# EAGLE design rev3 (EAGLE 6.4)
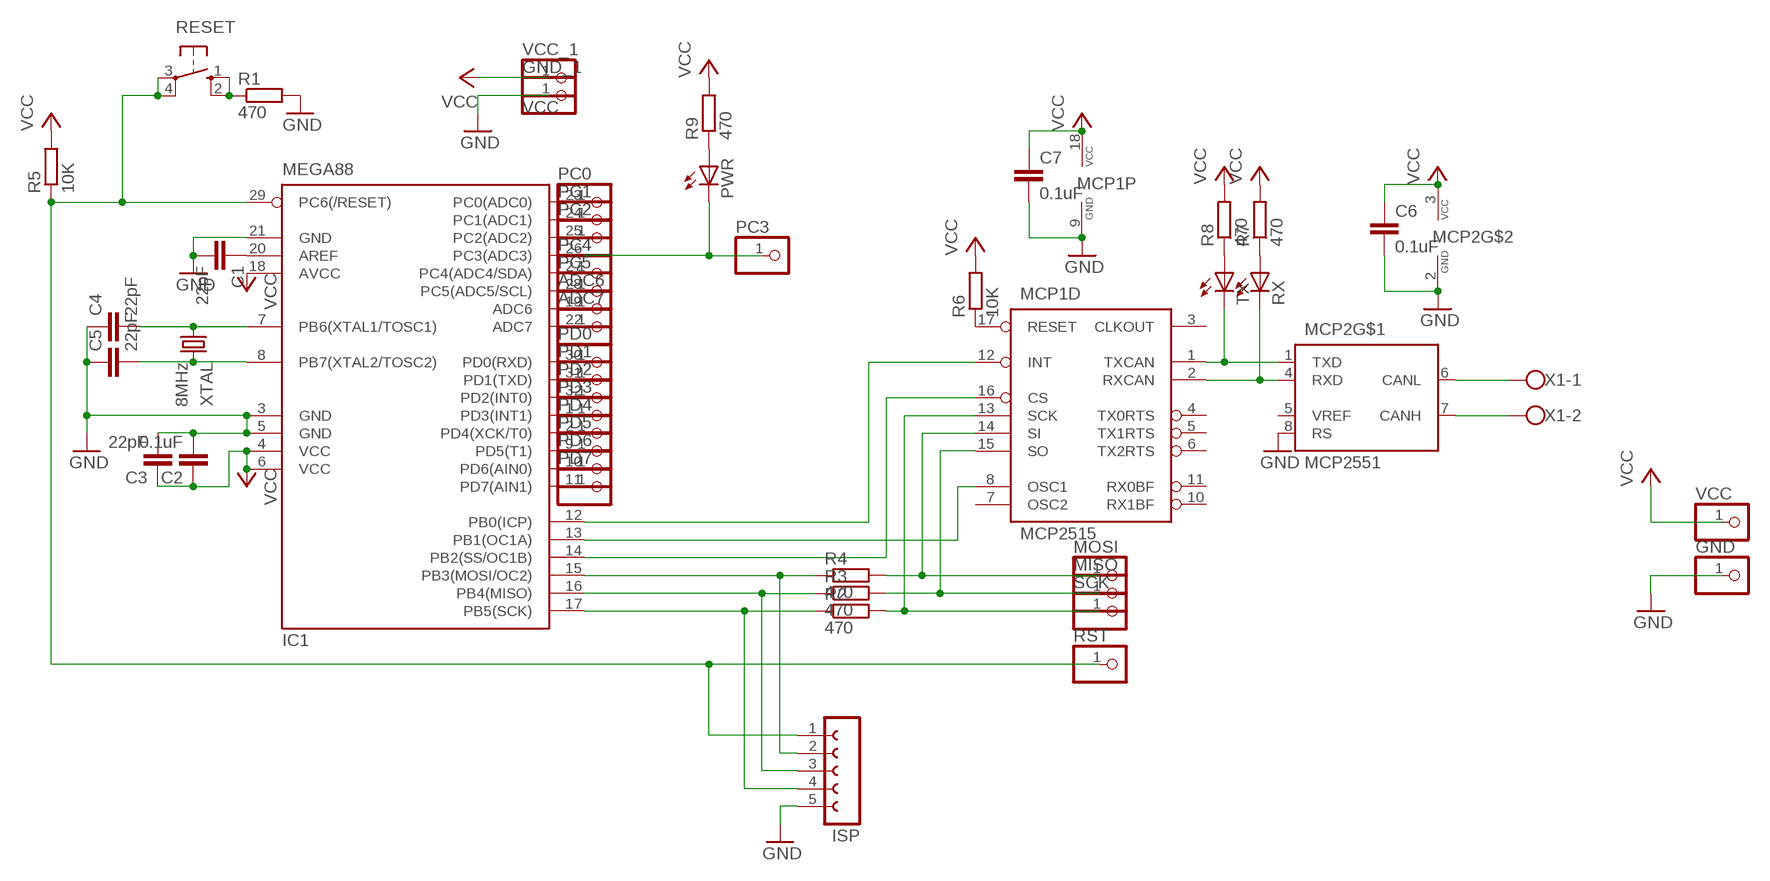
[diagram p0: schematic, sheet 1]

## Parts
ADC6  PINHD-1X1  [1X01]
ADC7  PINHD-1X1  [1X01]
C1  22pF  C-EUC0603  [C0603]
C2  0.1uF  C-EUC0603  [C0603]
C3  22pF  C-EUC0603  [C0603]
C4  22pF  C-EUC0603  [C0603]
C5  22pF  C-EUC0603  [C0603]
C6  0.1uF  C-EUC0603  [C0603]
C7  0.1uF  C-EUC0603  [C0603]
GND  PINHD-1X1  [1X01]
GND_1  PINHD-1X1  [1X01]
IC1  MEGA88  MEGA8-AI  [TQFP32-08]
ISP  FE05-1  [FE05-1]
MCP1  MCP2515  MCP2515P  [DIL18]
MCP2  MCP2551  MCP2551DIL8  [DIL08]
MISO  PINHD-1X1  [1X01]
MOSI  PINHD-1X1  [1X01]
PC0  PINHD-1X1  [1X01]
PC1  PINHD-1X1  [1X01]
PC2  PINHD-1X1  [1X01]
PC3  PINHD-1X1  [1X01]
PC4  PINHD-1X1  [1X01]
PC5  PINHD-1X1  [1X01]
PD0  PINHD-1X1  [1X01]
PD1  PINHD-1X1  [1X01]
PD2  PINHD-1X1  [1X01]
PD3  PINHD-1X1  [1X01]
PD4  PINHD-1X1  [1X01]
PD5  PINHD-1X1  [1X01]
PD6  PINHD-1X1  [1X01]
PD7  PINHD-1X1  [1X01]
PWR  LEDCHIP-LED0603  [CHIP-LED0603]
R1  470  R-EU_R0603  [R0603]
R2  470  R-EU_R0603  [R0603]
R3  470  R-EU_R0603  [R0603]
R4  470  R-EU_R0603  [R0603]
R5  10K  R-EU_R0603  [R0603]
R6  10K  R-EU_R0603  [R0603]
R7  470  R-EU_R0603  [R0603]
R8  470  R-EU_R0603  [R0603]
R9  470  R-EU_R0603  [R0603]
RESET  10-XX  [B3F-10XX]
RST  PINHD-1X1  [1X01]
RX  LEDCHIP-LED0603  [CHIP-LED0603]
SCK  PINHD-1X1  [1X01]
TX  LEDCHIP-LED0603  [CHIP-LED0603]
VCC  PINHD-1X1  [1X01]
VCC_1  VCC  PINHD-1X1  [1X01]
X1  W237-102  [W237-102]
XTAL  8MHz  CRYSTALHC49S  [HC49/S]

## Nets
GND: C1.2 C2.2 C3.2 C4.1 C5.1 C6.2 C7.2 GND.1 GND_1.1 IC1.3(GND) IC1.5(GND) IC1.21(GND) ISP.5 MCP1.9(P:GND) MCP2.2(GND) MCP2.8(RS) R1.2
N$1: C1.1 IC1.20(AREF)
N$2: IC1.16(PB4(MISO)) ISP.3 R3.1
N$3: MCP1.14(D:SI) MOSI.1 R4.2
N$4: IC1.14(PB2(SS/OC1B)) MCP1.16(D:CS)
N$5: IC1.13(PB1(OC1A)) MCP1.8(D:OSC1)
N$7: MCP1.1(D:TXCAN) MCP2.1(TXD) TX.C
N$9: C5.2 IC1.8(PB7(XTAL2/TOSC2)) XTAL.2
N$10: MCP2.6(CANL) X1.1
N$12: MCP1.17(D:RESET) R6.1
N$13: R1.1 RESET.1(S) RESET.2(S1)
N$14: IC1.12(PB0(ICP)) MCP1.12(D:INT)
N$15: MCP1.13(D:SCK) R2.2 SCK.1
N$16: MCP2.7(CANH) X1.2
N$17: IC1.15(PB3(MOSI/OC2)) ISP.2 R4.1
N$18: R8.1 TX.A
N$19: R7.1 RX.A
N$20: IC1.23(PC0(ADC0)) PC0.1
N$21: IC1.24(PC1(ADC1)) PC1.1
N$22: IC1.25(PC2(ADC2)) PC2.1
N$24: IC1.27(PC4(ADC4/SDA)) PC4.1
N$25: IC1.28(PC5(ADC5/SCL)) PC5.1
N$26: ADC6.1 IC1.19(ADC6)
N$27: ADC7.1 IC1.22(ADC7)
N$28: IC1.30(PD0(RXD)) PD0.1
N$29: IC1.31(PD1(TXD)) PD1.1
N$30: IC1.32(PD2(INT0)) PD2.1
N$31: IC1.1(PD3(INT1)) PD3.1
N$32: IC1.2(PD4(XCK/T0)) PD4.1
N$33: IC1.9(PD5(T1)) PD5.1
N$34: IC1.10(PD6(AIN0)) PD6.1
N$35: IC1.11(PD7(AIN1)) PD7.1
N$36: PWR.A R9.1
N$37: C4.2 IC1.7(PB6(XTAL1/TOSC1)) XTAL.1
N$38: MCP1.15(D:SO) MISO.1 R3.2
N$39: IC1.17(PB5(SCK)) ISP.4 R2.1
N$40: IC1.26(PC3(ADC3)) PC3.1 PWR.C
RESET: IC1.29(PC6(/RESET)) ISP.1 R5.1 RESET.3(P) RESET.4(P1) RST.1
RXLED: MCP1.2(D:RXCAN) MCP2.4(RXD) RX.C
VCC: C2.1 C3.1 C6.1 C7.1 IC1.4(VCC) IC1.6(VCC) IC1.18(AVCC) MCP1.18(P:VCC) MCP2.3(VCC) R5.2 R6.2 R7.2 R8.2 R9.2 VCC.1 VCC_1.1
Unconnected: MCP1.3(D:CLKOUT) MCP1.4(D:TX0RTS) MCP1.5(D:TX1RTS) MCP1.6(D:TX2RTS) MCP1.7(D:OSC2) MCP1.10(D:RX1BF) MCP1.11(D:RX0BF) MCP2.5(VREF)

## Library data of the parts
ADC6 ADC7 GND GND_1 MISO MOSI PC0 PC1-PC5 PD0 PD1-PD7 RST SCK VCC VCC_1 = pinhead:PINHD-1X1: PIN HEADER
C1-C7 = resistor:C-EU: CAPACITOR, European symbol; OC_NEWARK: unknown
IC1 = atmel:MEGA8: MICROCONTROLLER 8 Kbytes FLASH, 1 kbytes SRAM, 512 bytes EEPROM, USART, 6-channel 10 bit ADC, 2-channel 8 bit ADC Pin compatible with Atmega48, ATMega88, ATMega168 Source: avr.lbr; MPN: ATMEGA8-16AU; OC_FARNELL: 9171371; OC_NEWARK: unknown
ISP = con-lsta:FE05-1: FEMALE HEADER; OC_FARNELL: unknown; OC_NEWARK: unknown
MCP1 = can:MCP2515: MC2515 Stand-Alone CAN Controller With SPI Interface, Microchip; OC_NEWARK: unknown
MCP2 = can:MCP2551: CAN Tranceiver Microchip; OC_NEWARK: unknown
PWR RX TX = led:LED: LED OSRAM: - CHIPLED LG R971, LG N971, LY N971, LG Q971, LY Q971, LO R971, LY R971 LH N974, LH R974 LS Q976, LO Q976, LY Q976 LO Q996 - Hyper CHIPLED LW Q18S LB Q993, LB Q99A, LB R99A - SideLED LS A670, LO A670, LY A670, LG A670, LP A670 LB A673, LV A673, LT A673, LW A673 LH A674 LY A675 LS A676, LA A676, LO A676, LY A676, LW A676 LS A679, LY A679, LG A679 - Hyper Micro SIDELED® LS Y876, LA Y876, LO Y876, LY Y876 LT Y87S - SmartLED LW L88C, LW L88S LB L89C, LB L89S, LG L890 LS L89K, LO L89K, LY L89K LS L896, LA L896, LO L896, LY L896 - TOPLED LS T670, LO T670, LY T670, LG T670, LP T670 LSG T670, LSP T670, LSY T670, LOP T670, LYG T670 LG T671, LOG T671, LSG T671 LB T673, LV T673, LT T673, LW T673 LH T674 LS T676, LA T676, LO T676, LY T676, LB T676, LH T676, LSB T676, LW T676 LB T67C, LV T67C, LT T67C, LS T67K, LO T67K, LY T67K, LW E67C LS E67B, LA E67B, LO E67B, LY E67B, LB E67C, LV E67C, LT E67C LW T67C LS T679, LY T679, LG T679 LS T770, LO T770, LY T770, LG T770, LP T770 LB T773, LV T773, LT T773, LW T773 LH T774 LS E675, LA E675, LY E675, LS T675 LS T776, LA T776, LO T776, LY T776, LB T776 LHGB T686 LT T68C, LB T68C - Hyper Mini TOPLED® LB M676 - Mini TOPLED Santana® LG M470 LS M47K, LO M47K, LY M47K Source: http://www.osram.convergy.de LUXEON: - LUMILED® LXK2-PW12-R00, LXK2-PW12-S00, LXK2-PW14-U00, LXK2-PW14-V00 LXK2-PM12-R00, LXK2-PM12-S00, LXK2-PM14-U00 LXK2-PE12-Q00, LXK2-PE12-R00, LXK2-PE12-S00, LXK2-PE14-T00, LXK2-PE14-U00 LXK2-PB12-K00, LXK2-PB12-L00, LXK2-PB12-M00, LXK2-PB14-N00, LXK2-PB14-P00, LXK2-PB14-Q00 LXK2-PR12-L00, LXK2-PR12-M00, LXK2-PR14-Q00, LXK2-PR14-R00 LXK2-PD12-Q00, LXK2-PD12-R00, LXK2-PD12-S00 LXK2-PH12-R00, LXK2-PH12-S00 LXK2-PL12-P00, LXK2-PL12-Q00, LXK2-PL12-R00 Source: www.luxeon.com KINGBRIGHT: KA-3528ASYC Source: www.kingbright.com
R1-R9 = resistor:R-EU_: RESISTOR, European symbol; OC_NEWARK: unknown
RESET = switch-omron:10-XX: OMRON SWITCH; MPN: B3F-1000; OC_FARNELL: 176432; OC_NEWARK: 36M3542
X1 = con-wago-500:W237-102: WAGO SCREW CLAMP; MPN: 237-102; OC_FARNELL: unknown; OC_NEWARK: 70K9898
XTAL = crystal:CRYSTAL: CRYSTAL; OC_FARNELL: 1667008; OC_NEWARK: unknown

## Board
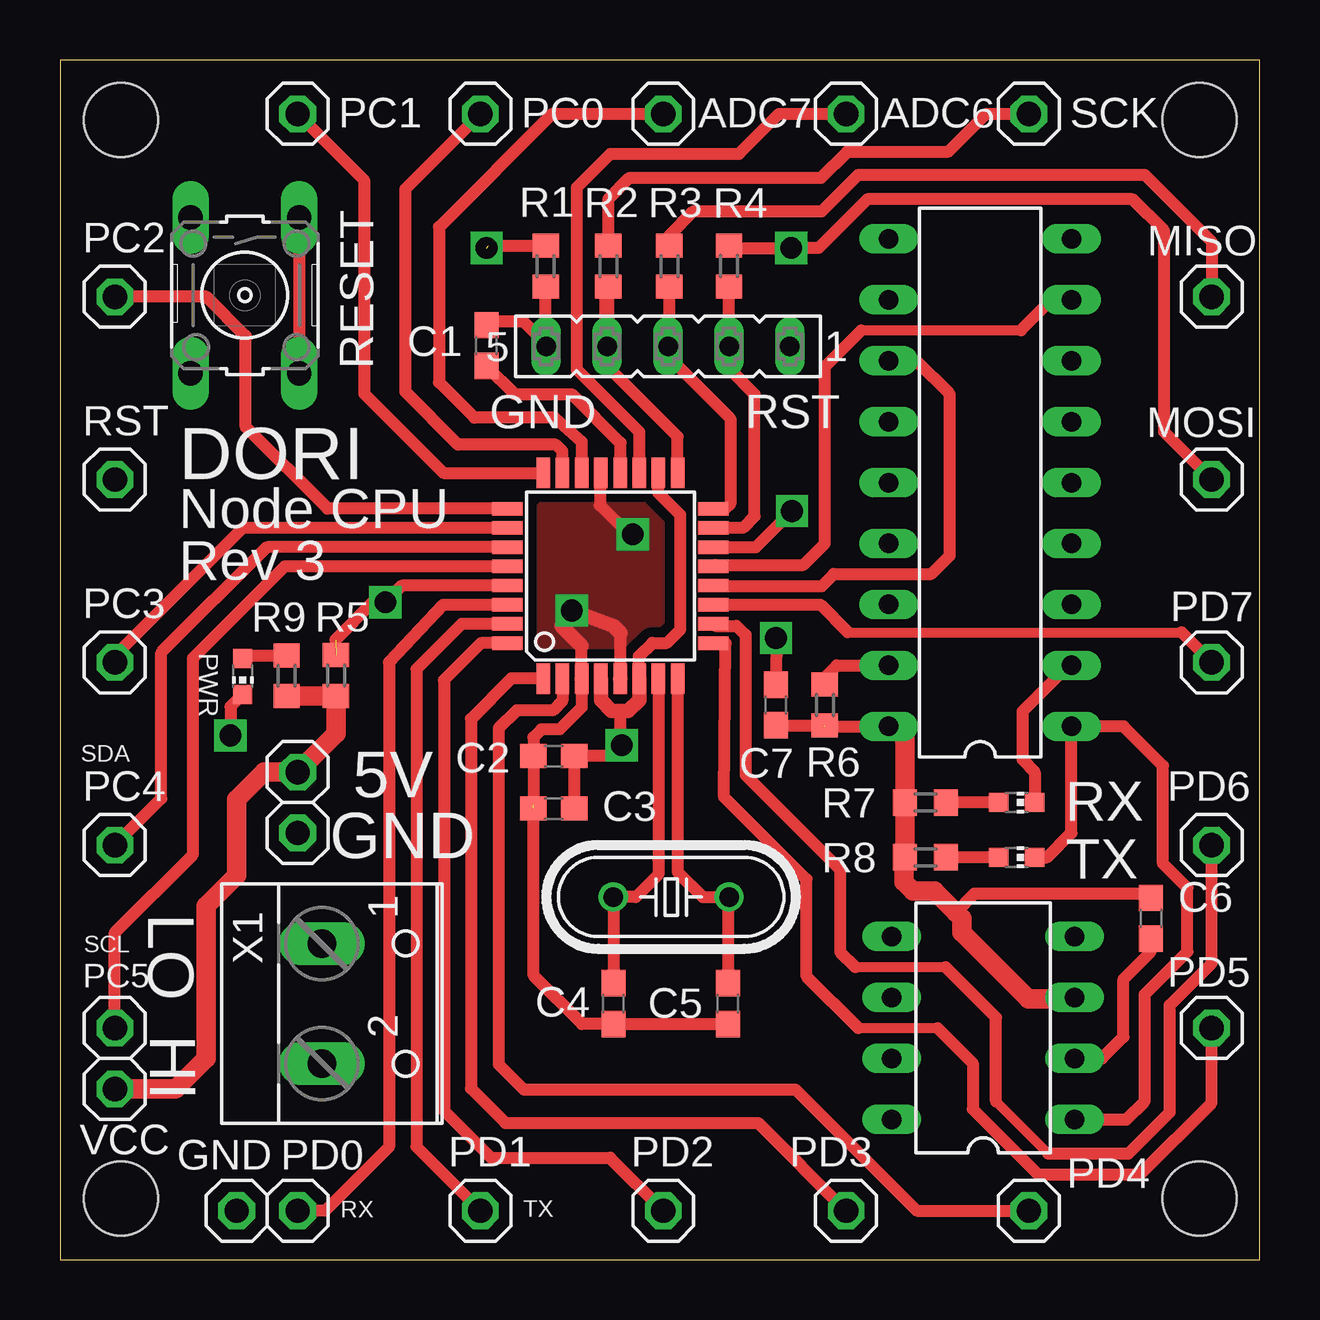
[diagram p1: board, top side]
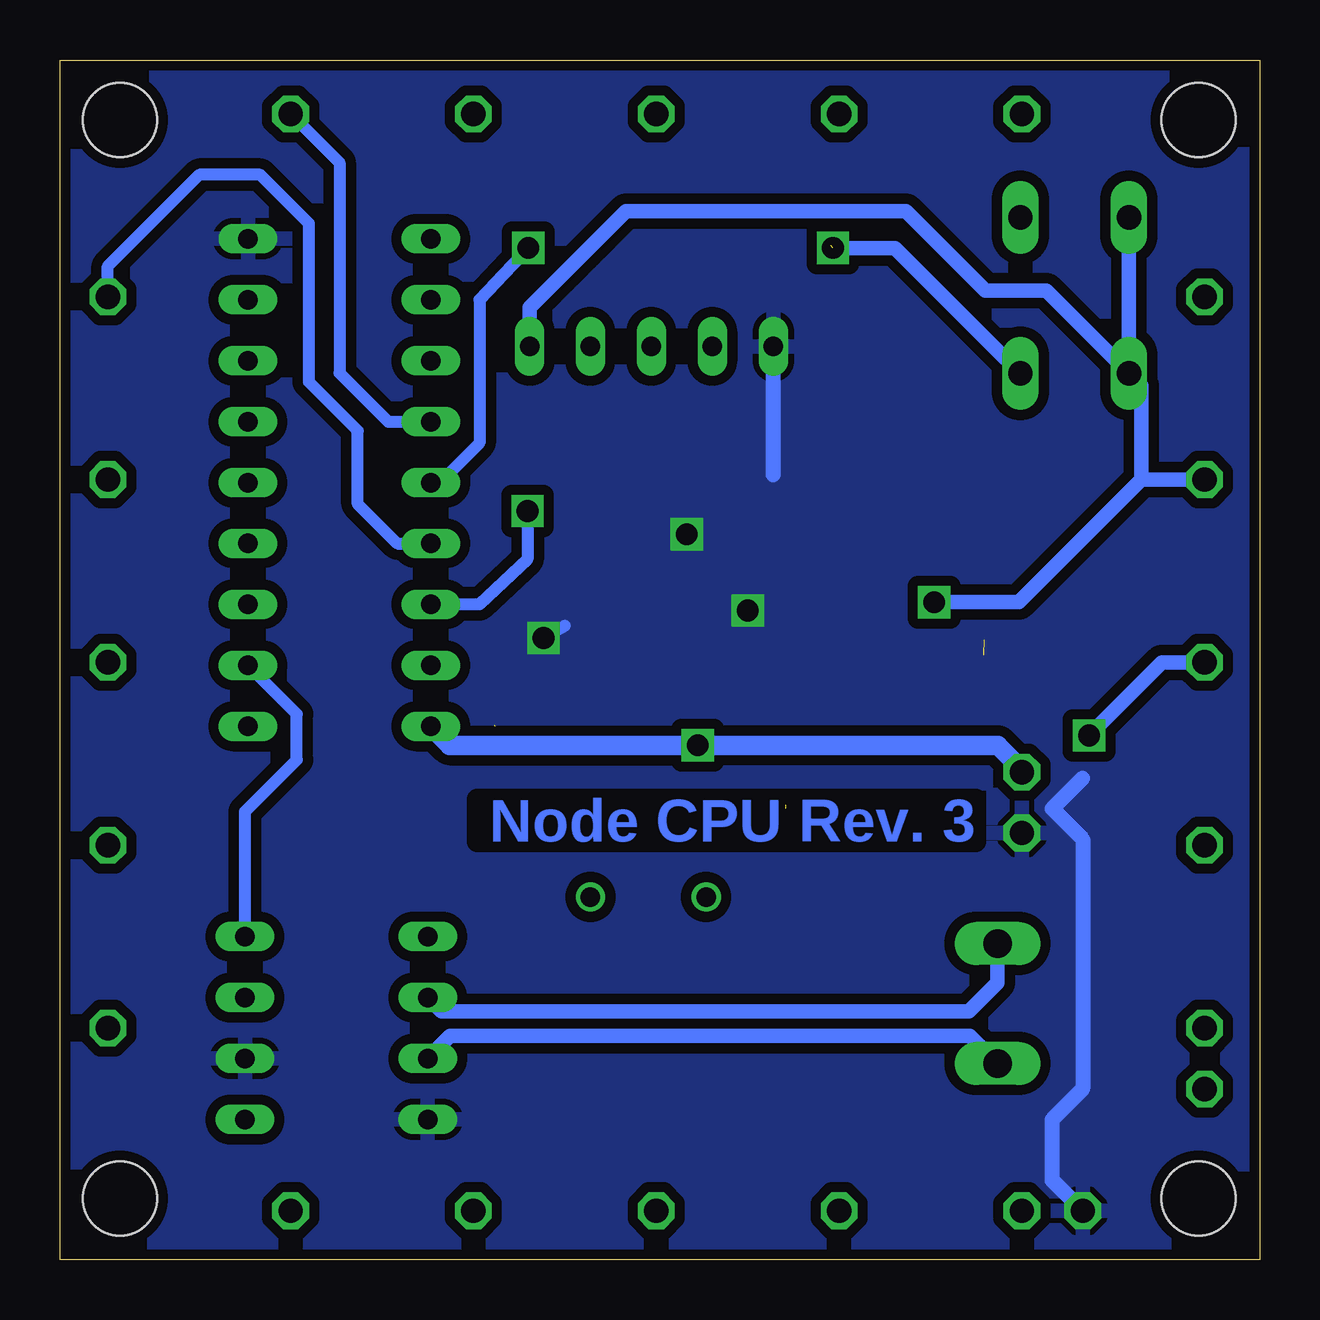
[diagram p2: board, bottom side, seen from below]

Size 50 x 50 mm. Coordinates in mm from the lower left corner, seen from the top.
Outline: 0,0 50,0 50,50 0,50 0,0
Copper layers (1*2*15*16): Top 0.035mm / dielectric 0.2mm / layer 2 0.0175mm / dielectric 1.1mm / layer 15 0.0175mm / dielectric 0.2mm / Bottom 0.035mm
Design rules "SeeedStudio_DRU_no_angle_20130527": minimum track width 6mil, minimum drill 12mil, track to track 6mil, track to pad 6mil, pad to pad 6mil, via to via 6mil, smd to smd 0mil, copper to edge 10mil, drill to drill 10mil, minimum pad ring 6mil, minimum via ring 6mil, stop-mask expansion 2mil, vias tented up to drill 25mil, thermal gap 10mil
Holes 3.1 mm at 2.54,47.5 47.5,47.5 47.5,2.54 2.54,2.54

### Footprints (pad centres in the part's own frame; a part is rotated, then mirrored left to right if it is on the bottom)
1X01 = drill 1.016 octagon: 1 0,0
C0603 = smd 1.1 x 1: 1 -0.85,0; 2 0.85,0
TQFP32-08 = smd 1.27 x 0.559: 1 -4.293,2.8; 2 -4.293,2; 3 -4.293,1.2; 4 -4.293,0.4; 5 -4.293,-0.4; 6 -4.293,-1.2; 7 -4.293,-2; 8 -4.293,-2.8; 17 4.293,-2.8; 18 4.293,-2; 19 4.293,-1.2; 20 4.293,-0.4; 21 4.293,0.4; 22 4.293,1.2; 23 4.293,2; 24 4.293,2.8 | smd 0.559 x 1.27: 9 -2.8,-4.293; 10 -2,-4.293; 11 -1.2,-4.293; 12 -0.4,-4.293; 13 0.4,-4.293; 14 1.2,-4.293; 15 2,-4.293; 16 2.8,-4.293; 25 2.8,4.293; 26 2,4.293; 27 1.2,4.293; 28 0.4,4.293; 29 -0.4,4.293; 30 -1.2,4.293; 31 -2,4.293; 32 -2.8,4.293
FE05-1 = drill 0.813 long: 1 -5.08,0; 2 -2.54,0; 3 0,0; 4 2.54,0; 5 5.08,0
DIL18 = drill 0.813 long: 1 -10.16,-3.81; 2 -7.62,-3.81; 3 -5.08,-3.81; 4 -2.54,-3.81; 5 0,-3.81; 6 2.54,-3.81; 7 5.08,-3.81; 8 7.62,-3.81; 9 10.16,-3.81; 10 10.16,3.81; 11 7.62,3.81; 12 5.08,3.81; 13 2.54,3.81; 14 0,3.81; 15 -2.54,3.81; 16 -5.08,3.81; 17 -7.62,3.81; 18 -10.16,3.81
DIL08 = drill 0.813 long: 1 -3.81,-3.81; 2 -1.27,-3.81; 3 1.27,-3.81; 4 3.81,-3.81; 5 3.81,3.81; 6 1.27,3.81; 7 -1.27,3.81; 8 -3.81,3.81
CHIP-LED0603 = smd 0.8 x 0.8: A 0,-0.75; C 0,0.75
R0603 = smd 1 x 1.1: 1 -0.85,0; 2 0.85,0
B3F-10XX = drill 1.016 long: 1 -3.251,2.261; 2 3.251,2.261; 3 -3.251,-2.261; 4 3.251,-2.261
W237-102 = drill 1.194 long: 1 -2.5,-1.27; 2 2.5,-1.27
HC49/S = drill 0.813: 1 -2.413,0; 2 2.413,0

### Placement (x,y rotation side)
ADC6  32.77,47.75 0 top
ADC7  25.15,47.75 0 top
C1  17.78,38.1 90 top
C2  20.58,20.99 180 top
C3  20.58,18.8 180 top
C4  23.06,10.67 90 top
C5  27.84,10.67 90 top
C6  45.47,14.22 270 top
C7  29.84,23.11 90 top
GND  7.37,2.03 0 top
GND_1  9.91,17.78 0 top
IC1  22.95,28.49 90 top
ISP  25.35,38.06 180 top
MCP1  38.35,32.38 90 top
MCP2  38.48,9.65 90 top
MISO  48.01,40.13 0 top
MOSI  48.01,32.51 0 top
PC0  17.53,47.75 0 top
PC1  9.91,47.75 0 top
PC2  2.29,40.13 0 top
PC3  2.29,24.89 0 top
PC4  2.29,17.27 0 top
PC5  2.29,9.65 0 top
PD0  9.91,2.03 0 top
PD1  17.53,2.03 0 top
PD2  25.15,2.03 0 top
PD3  32.77,2.03 0 top
PD4  40.39,2.03 0 top
PD5  48.01,9.65 0 top
PD6  48.01,17.27 0 top
PD7  48.01,24.89 0 top
PWR  7.62,24.31 180 top
R1  20.25,41.4 270 top
R2  22.86,41.4 90 top
R3  25.4,41.4 90 top
R4  27.89,41.4 90 top
R5  11.5,24.35 270 top
R6  31.88,23.11 270 top
R7  36.07,19.05 180 top
R8  36.07,16.76 180 top
R9  9.45,24.33 270 top
RESET  7.71,40.19 270 top
RST  2.29,32.51 0 top
RX  39.88,19.05 270 top
SCK  40.39,47.75 0 top
TX  39.88,16.76 270 top
VCC  2.29,7.11 0 top
VCC_1  9.91,20.32 0 top
X1  12.19,10.67 270 top
XTAL  25.48,15.11 0 top

### Tracks (layer width: path | path; a pad name or v marks a point on that pad's centre or on a via)
GND  (via drill 0.9)  (1 unrouted)
  Top 0.508: C5.1 C4.1 21.76,9.82 19.75,11.83 19.75,18.94 | C3.2 C2.2 19.73,21.77 20.07,22.1 20.83,22.1 21.75,23.02 IC1.3 | 20.27,36.97 ISP.5 20.25,38.08 20.25,38.61 | 20.25,38.61 R1.2 | IC1.21 22.5,32.74 22.5,31.45 23.47,30.48 v23.88,30.23 | C1.2 17.95,39.12 19.3,39.12 19.81,38.61 20.25,38.61 | 23.37,24.22 23.37,26.11 | IC1.3 21.74,25.58 | MCP2.2 43.43,8.38 44.32,9.27 44.32,11.68 45.47,12.83 C6.2 | C7.2 29.88,25.49 v29.84,25.91
  Top 0.61: IC1.3 | 21.74,25.58 20.9,26.42 v21.34,27.05 23.06,26.42 23.37,26.11 | IC1.5 23.37,24.22
  Bottom 0.508: v29.84,25.91 28.96,26.42
  Bottom 0.635: 20.27,32.71 ISP.5 | 7.37,20.07 8.64,18.8 7.37,17.53 7.37,7.11 8.64,5.84 8.64,3.3 GND.1
  pour Bottom (isolate 0.432): -0.51,-0.51 50.29,-0.51 50.29,50.29 -0.51,50.29
  pour Top (isolate 0.406): 20.07,31.37 20.07,25.65 26.04,25.65 26.04,31.37
N$1
  Top 0.508: IC1.20 23.37,32.81 23.37,34.04 21.34,36.07 18.96,36.07 C1.1
N$2
  Top 0.508: IC1.16 27.74,31.29 27.94,31.5 27.94,35.05 25.4,37.59 25.4,38.01 ISP.3 25.4,38.12 R3.1
N$3  (via drill 0.9)
  Top 0.508: R4.2 27.94,42.16 v30.48,42.16 31.62,42.16 33.66,44.2 44.7,44.2 46.02,42.88 46.02,34.49 MOSI.1
  Bottom 0.508: v30.48,42.16 32.51,40.01 32.51,34.04 34.16,32.38 MCP1.14
N$4  (via drill 0.9)
  Top 0.508: IC1.14 29,29.69 v30.51,31.2
  Bottom 0.508: v30.51,31.2 30.51,29.18 32.51,27.3 MCP1.16
N$5
  Top 0.406: 33.4,38.73 40.06,38.73
  Top 0.508: IC1.13 27.3,28.96 30.99,28.96 31.88,29.84 31.88,37.21 33.4,38.73 | 40.06,38.73 41.45,40.13 MCP1.8
N$7
  Top 0.508: MCP2.1 44.45,5.84 45.21,6.6 45.21,11.05 46.99,12.83 46.99,15.49 45.97,16.51 45.97,20.57 44.32,22.23 MCP1.1 42.16,17.78 41.15,16.76 TX.C
N$9
  Top 0.508: IC1.8 25.75,16.75 25.75,16.16 26.8,15.11 XTAL.2 27.84,14.94 C5.2
N$10
  Bottom 0.61: MCP2.6 34.09,10.34 12.12,10.34 10.92,11.53 X1.1
N$12
  Top 0.508: R6.1 31.88,24.26 32.38,24.77 MCP1.17
N$13  (via drill 0.9)  (1 unrouted)
  Top 0.508: RESET.1 RESET.2 | 17.87,42.25 R1.1
  Bottom 0.61: RESET.2 11.13,38.1 15.19,42.16 v17.78,42.16
N$14
  Top 0.508: IC1.12 27.26,28.07 31.75,28.07 32.26,28.57 36.32,28.57 37.08,29.34 37.08,36.07 35.69,37.47 MCP1.12
N$15
  Top 0.508: SCK.1 38.61,47.75 37.03,46.18 32.82,46.18 31.73,45.09 23.75,45.09 22.86,44.2 R2.2
  Bottom 0.508: SCK.1 38.35,45.72 38.35,36.96 36.32,34.92 MCP1.13
N$16
  Bottom 0.61: X1.2 12.08,9.32 33.73,9.32 MCP2.7
N$17
  Top 0.508: IC1.15 28.46,30.49 28.96,30.99 28.96,36.07 27.94,37.08 27.94,38.01 ISP.2 R4.1
N$18
  Top 0.508: TX.A R8.1
N$19
  Top 0.508: RX.A R7.1
N$20
  Top 0.508: IC1.23 20.95,33.69 20.67,33.97 16.6,33.97 14.4,36.17 14.4,44.63 PC0.1
N$21
  Top 0.508: IC1.24 15.98,32.78 12.69,36.08 12.69,44.97 PC1.1
N$22
  Top 0.508: IC1.25 11.15,31.29 7.75,34.69 7.75,38.49 6.11,40.13 PC2.1 2.33,40.09
N$24
  Top 0.508: PC4.1 4.23,19.21 4.23,25.29 8.63,29.69 IC1.27
N$25
  Top 0.508: IC1.28 9.37,28.89 5.55,25.07 5.55,16.89 2.29,13.63 PC5.1
N$26
  Top 0.508: IC1.19 24.15,34.49 21.55,37.09 21.55,44.69 22.95,46.09 28.31,46.09 29.97,47.75 ADC6.1
N$27
  Top 0.508: IC1.22 21.75,34.09 20.62,35.09 17.27,35.09 15.8,36.56 15.8,43.03 20.52,47.75 ADC7.1
N$28
  Top 0.508: IC1.30 15.99,27.29 13.71,24.89 13.71,4.7 11.05,2.03 PD0.1
N$29
  Top 0.508: IC1.31 16.75,26.49 14.86,24.61 14.86,4.7 PD1.1 17.53,2.11
N$30
  Top 0.508: IC1.32 17.55,25.69 16,24.15 16,6.2 17.96,4.24 22.94,4.24 PD2.1
N$31
  Top 0.508: IC1.1 20.17,24.22 18.81,24.22 17.13,22.54 17.13,7.13 18.57,5.69 29.11,5.69 PD3.1
N$32
  Top 0.508: IC1.2 20.95,23.29 20.55,22.89 19.05,22.89 18.29,22.14 18.29,8.13 19.32,7.09 20.76,7.09 21.59,7.09 30.65,7.09 35.71,2.03 PD4.1
N$33
  Top 0.406: 33.27,9.65 36.58,9.65
  Top 0.508: IC1.9 27.75,25.69 27.69,19.27 31.11,15.85 31.11,11.81 33.27,9.65 | 36.58,9.65 38.05,8.18 38.05,6.26 40.76,3.55 45.02,3.55 48.01,6.53 PD5.1
N$34
  Top 0.406: 39.02,6.58 41.18,4.42 | 33.15,12.19 36.92,12.19
  Top 0.508: 41.18,4.42 44.54,4.42 46.25,6.13 46.25,10.6 48.01,12.35 PD6.1 | 39.02,6.58 39.02,10.09 36.92,12.19 | 33.15,12.19 32.51,12.83 32.51,16.26 28.57,20.19 28.57,26.04 28.19,26.42 27.32,26.42 IC1.10
N$35
  Top 0.406: 32.84,26.14 46.76,26.14
  Top 0.508: IC1.11 31.69,27.29 32.84,26.14 | 46.76,26.14 PD7.1
N$36
  Top 0.508: PWR.A 7.75,25.18 R9.1
N$37
  Top 0.508: IC1.7 24.95,16.69 24.95,16.06 24,15.11 XTAL.1 C4.2
N$38
  Top 0.508: MISO.1 48.01,42.42 45.21,45.21 33.27,45.21 31.75,43.69 26.42,43.69 25.4,42.67 R3.2
  Bottom 0.508: MISO.1 48.01,41.4 44.2,45.21 41.66,45.21 39.62,43.18 39.62,36.58 37.59,34.54 37.59,31.5 35.94,29.84 MCP1.15
N$39
  Top 0.508: IC1.17 25.75,34.29 22.81,37.23
  Top 0.635: 22.81,37.23 ISP.4 22.81,40.37 R2.1
N$40  (via drill 0.9)
  Top 0.508: IC1.26 7.62,30.48 2.29,25.15 PC3.1 | PWR.C 7.11,23.05 v7.11,21.84
  Bottom 0.61: v7.11,21.84 4.06,24.89 PC3.1
RESET  (via drill 0.9)  (1 unrouted)
  Top 0.508: IC1.29 14.25,28.09 v13.56,27.4 13.05,27.4 11.48,25.83
  Bottom 0.61: 4.93,32.51 RST.1 | 4.93,32.51 4.93,36.42 RESET.4 6.1,37.59 | 6.1,37.59 8.89,40.38 11.43,40.38 14.73,43.69 26.42,43.69 30.43,39.68 30.43,39.17 ISP.1 | 4.93,32.51 10.04,27.4 v13.56,27.4 | RESET.3 5.45,38.24 6.1,37.59
RXLED
  Top 0.508: MCP1.2 42.16,24.89 40.13,22.86 40.13,20.83 40.63,20.31 RX.C
  Bottom 0.508: MCP2.4 42.29,18.67 40.13,20.83 40.13,22.73 MCP1.2
VCC  (via drill 0.9)  (1 unrouted)
  Top 0.508: C3.1 C2.1 22.88,20.99 23.37,21.48 | IC1.6 24.13,24.21 24.13,25.15 24.69,25.7 25.3,25.7 25.86,26.26 25.86,31.04 24.95,31.95 IC1.18 | v23.41,21.43 23.37,21.48 | 23.37,21.48 23.37,22.86 | MCP2.3 42.34,10.87 42.88,10.87 | 37.34,14.48 38.1,15.24 45.3,15.24 C6.1 | 31.84,22.23 MCP1.18 | C7.1 R6.2
  Top 0.61: IC1.4 22.55,23.33 22.99,22.86 23.37,22.86 23.67,22.86 24.15,23.33 IC1.6
  Top 0.813: VCC.1 4.83,7.11 6.1,8.38 6.1,14.73 7.37,16 7.37,19.18 8.51,20.32 VCC_1.1 11.5,21.92 R5.2 9.46,23.5 R9.2 | 42.88,10.87 40.36,10.87 37.59,13.64 37.59,14.22 37.34,14.48 36.45,15.37 35.56,15.37 35.18,15.75 35.18,16.76 R8.2 R7.2 35.22,21.8 MCP1.18
  Bottom 0.813: VCC_1.1 9.91,20.43 10.91,21.43 v23.41,21.43 33.75,21.43 MCP1.18

### Text on the board
Bottom: Node CPU Rev. 3
tNames: GND | RST | DORI | Node CPU | Rev 3 | SDA | 5V | GND | SCL | LO | HI | RX | TX